# EasyEDA Pro project FLIGHT-CONTROLLER_VERSION_2.eprj

# Schematic FLIGHT CONTROLLER
Board Name: FLIGHT CONTROLLER; Create Date: 2025-07-14; Page Name: Sheet_1; Project Name: FLIGHT-CONTROLLER_VERSION-2; Schematic Name: FLIGHT CONTROLLER; Update Date: 2025-07-15; Add into BOM: yes; Company: Your Company; Convert to PCB: yes; Date: 2025-07-08; Draw By: Jinalka Herath; REV: 1.0; Sheet: 1/1; spicePre: .
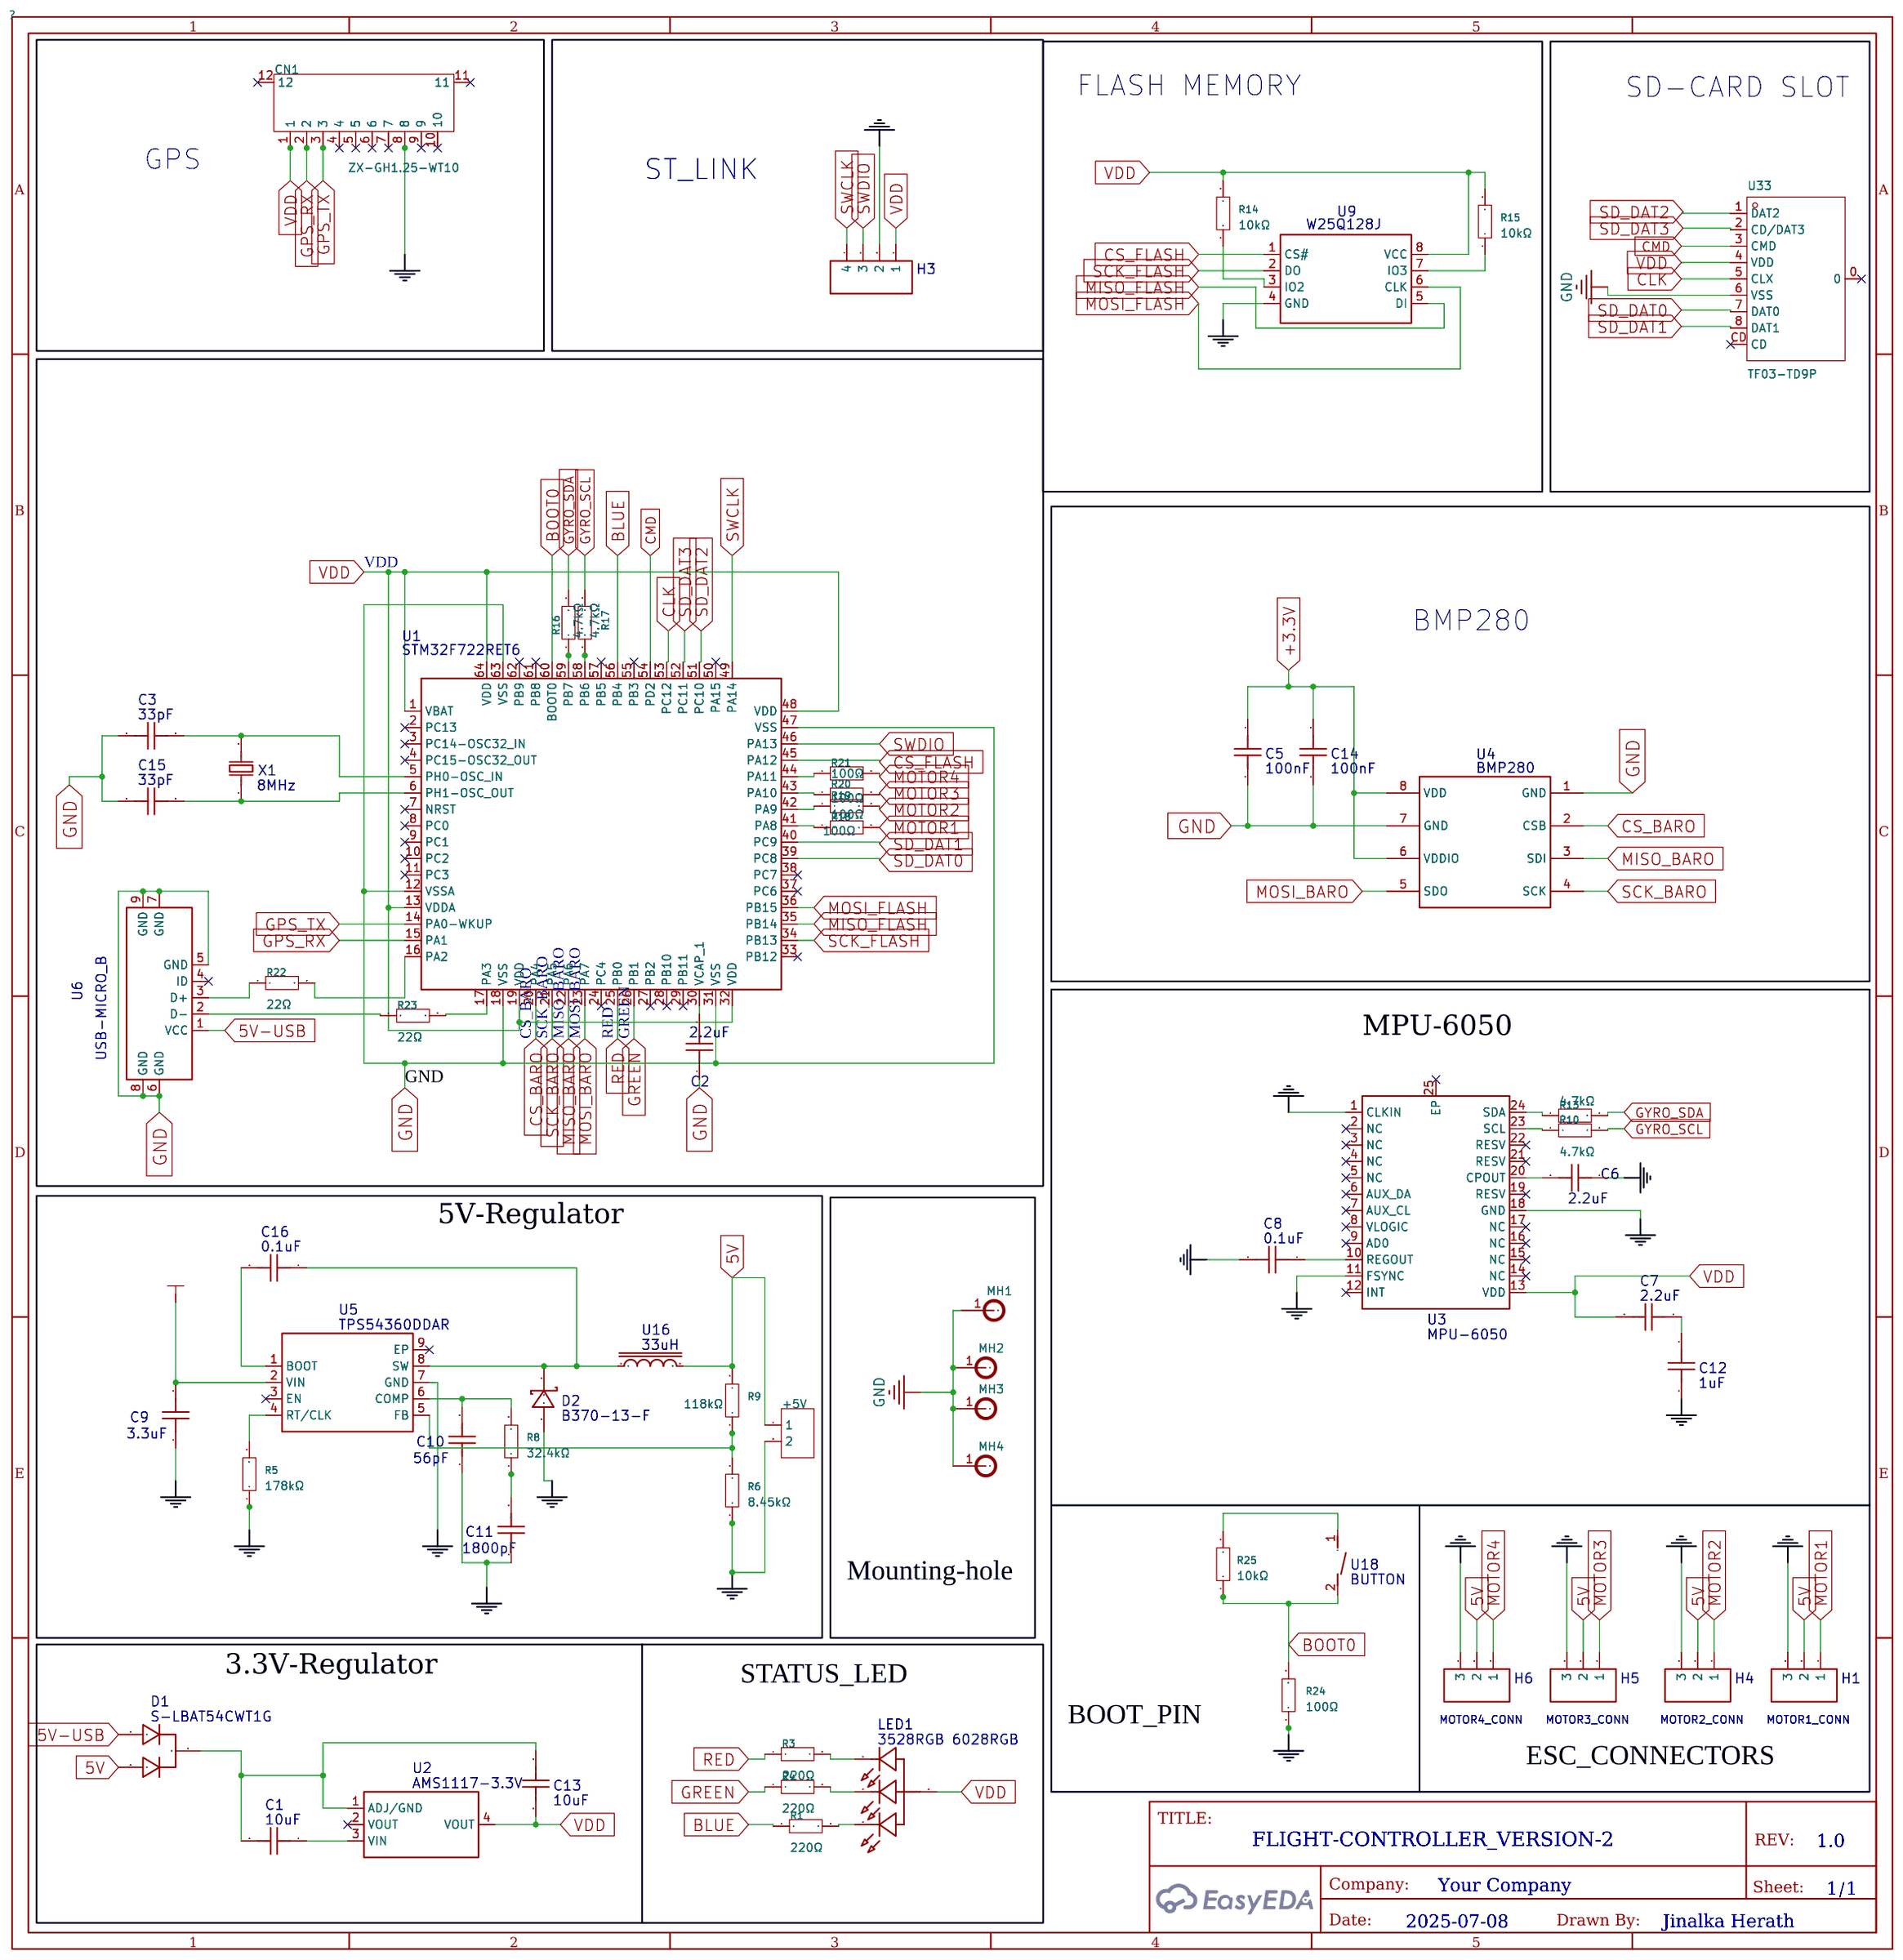
[diagram p0: schematic sheet]

## Parts
C1  10uF  [C0603]
C2  2.2uF  [CAP-SMD_L3.2-W2.5-1]
C3  33pF  [C0603]
C5  100nF  [C0603]
C6  2.2uF  [C0603]
C7  2.2uF  [C0603]
C8  0.1uF  [C0603]
C9  3.3uF  [C0603]
C10  56pF  [C0603]
C11  1800pF  [C0603]
C12  1uF  [C0603]
C13  10uF  [C0603]
C14  100nF  [C0603]
C15  33pF  [C0603]
C16  0.1uF  [C0603]
CN1  ZX-GH1.25-WT10  [CONN-SMD_ZX-GH1.25-WT10]
D1  S-LBAT54CWT1G  [SC-70-3_L2.0-W1.3-P1.30-LS2.1-BR]
D2  B370-13-F  [SMC_L7.1-W6.2-LS8.1-RD]
H1  MOTOR1_CONN  [HDR-F-2.54_1X3]
H3  ST_LINK  [HDR-F-2.54_1X4]
H4  MOTOR2_CONN  [HDR-F-2.54_1X3]
H5  MOTOR3_CONN  [HDR-F-2.54_1X3]
H6  MOTOR4_CONN  [HDR-F-2.54_1X3]
H7  +5V  [HDR-TH_2P-P2.54-V-F]
LED1  3528RGB 6028RGB  [LED-SMD_4P-L3.5-W2.8_3528RGB-6028RGB]
MH1  -  [MH_7.5]  (no BOM)
MH2  -  [MH_7.5]  (no BOM)
MH3  -  [MH_7.5]  (no BOM)
MH4  -  [MH_7.5]  (no BOM)
R1  220Ω  [R0805]
R3  220Ω  [R0805]
R4  220Ω  [R0805]
R5  178kΩ  [R0805]
R6  8.45kΩ  [R0805]
R8  32.4kΩ  [R0805]
R9  118kΩ  [R0805]
R10  4.7kΩ  [R0805]
R13  4.7kΩ  [R0805]
R14  10kΩ  [R0805]
R15  10kΩ  [R0805]
R16  4.7kΩ  [R0805]
R17  4.7kΩ  [R0805]
R18  100Ω  [R0805]
R19  100Ω  [R0805]
R20  100Ω  [R0805]
R21  100Ω  [R0805]
R22  22Ω  [R0805]
R23  22Ω  [R0805]
R24  100Ω  [R0805]
R25  10kΩ  [R0805]
U1  STM32F722RET6  [LQFP-64_L10.0-W10.0-P0.50-LS12.0-BL]
U2  AMS1117-3.3V  [SOT-223-4_L6.5-W3.5-P2.30-LS7.0-BR]
U3  MPU-6050  [QFN-24_L4.0-W4.0-P0.50-BL-EP2.7]
U4  BMP280  [LGA-8_L2.5-W2.0-P0.65_AMP6127]
U5  TPS54360DDAR  [ESOP-8_L4.9-W3.9-P1.27-LS6.0-BL-EP]
U6  USB-MICRO_B  [MICRO-USB-SMD_USB-MICRO_B]
U9  W25Q128J  [SOIC-8_L5.3-W5.3-P1.27-LS8.0-BL]
U16  33uH  [IND-SMD_L8.5-W8.0_SMS0850]
U18  BUTTON  [KEY-SMD_L6.0-W6.0-LS6.6]
U33  TF03-TD9P  [CONN-SMD_TF-001A-P]
X1  8MHz  [CRYSTAL-SMD_L3.2-W2.5_3225-8MHZ]

## Library data of the parts
C1 C13 = 10uF: Supplier: LCSC; Supplier Part: C3884822; Manufacturer: TDK; Manufacturer Part: C1608CH2A560J080AA; JLCPCB Part Class: Extended Part; Contributor: lcsc; nameAlias: Value; spicePre: C; spiceSymbolName: C1608CH2A560J080AA
C2 = 2.2uF: Supplier: LCSC; Supplier Part: C3778570; Manufacturer: rubycon(红宝石); Manufacturer Part: 25MU225MB23225; JLCPCB Part Class: Extended Part; Contributor: lcsc; nameAlias: Value; spicePre: C; spiceSymbolName: 25MU225MB23225
C3 C15 = 33pF: Supplier: LCSC; Supplier Part: C3884822; Manufacturer: TDK; Manufacturer Part: C1608CH2A560J080AA; JLCPCB Part Class: Extended Part; Contributor: lcsc; nameAlias: Value; spicePre: C; spiceSymbolName: C1608CH2A560J080AA
C5 C14 = 100nF: Supplier: LCSC; Supplier Part: C3884822; Manufacturer: TDK; Manufacturer Part: C1608CH2A560J080AA; JLCPCB Part Class: Extended Part; Contributor: lcsc; nameAlias: Value; spicePre: C; spiceSymbolName: C1608CH2A560J080AA
C6 C7 = 2.2uF: Supplier: LCSC; Supplier Part: C3884822; Manufacturer: TDK; Manufacturer Part: C1608CH2A560J080AA; JLCPCB Part Class: Extended Part; Contributor: lcsc; nameAlias: Value; spicePre: C; spiceSymbolName: C1608CH2A560J080AA
C8 C16 = 0.1uF: Supplier: LCSC; Supplier Part: C3884822; Manufacturer: TDK; Manufacturer Part: C1608CH2A560J080AA; JLCPCB Part Class: Extended Part; Contributor: lcsc; nameAlias: Value; spicePre: C; spiceSymbolName: C1608CH2A560J080AA
C9 = 3.3uF: Supplier: LCSC; Supplier Part: C3884822; Manufacturer: TDK; Manufacturer Part: C1608CH2A560J080AA; JLCPCB Part Class: Extended Part; Contributor: lcsc; nameAlias: Value; spicePre: C; spiceSymbolName: C1608CH2A560J080AA
C10 = 56pF: Supplier: LCSC; Supplier Part: C3884822; Manufacturer: TDK; Manufacturer Part: C1608CH2A560J080AA; JLCPCB Part Class: Extended Part; Contributor: lcsc; nameAlias: Value; spicePre: C; spiceSymbolName: C1608CH2A560J080AA
C11 = 1800pF: Supplier: LCSC; Supplier Part: C3884822; Manufacturer: TDK; Manufacturer Part: C1608CH2A560J080AA; JLCPCB Part Class: Extended Part; Contributor: lcsc; nameAlias: Value; spicePre: C; spiceSymbolName: C1608CH2A560J080AA
C12 = 1uF: Supplier: LCSC; Supplier Part: C3884822; Manufacturer: TDK; Manufacturer Part: C1608CH2A560J080AA; JLCPCB Part Class: Extended Part; Contributor: lcsc; nameAlias: Value; spicePre: C; spiceSymbolName: C1608CH2A560J080AA
CN1 = ZX-GH1.25-WT10: Pins Structure:1x10P Pitch:1.25mm Mounting Type:Surface Mount, Right Angle Reference Series:GH Number of Pins:10P Number of Rows:1 Number of PINs Per Row:10 Row Spacing:- Current Rating:1A Contact Material:Phosphor Bronze Contact Plating:Tin Operating Tem; LCSC Part Name: 1x10P 间距:1.25mm 卧贴 系列:GH; Supplier Part: C7429523; Manufacturer: Megastar(兆星); Supplier Footprint: SMD,P=1.25mm,卧贴; JLCPCB Part Class: Extended Part; Datasheet: https://atta.szlcsc.com/upload/public/pdf/source/20230619/4B2B28B10338DA0EF18CC8BF26211619.pdf; Supplier: LCSC; Pins Structure: 1x10P; Pitch: 1.25mm; Mounting Type: Surface Mount, Right Angle; Reference Series: GH; Number of Pins: 10P; Number of Rows: 1; Number of PINs Per Row: 10; Current Rating: 1A; Contact Material: Phosphor Bronze; Contact Plating: Tin; Operating Temperature: -25℃~+85℃; Voltage Rating: 125V; Plastic Material: LCP; Supplementary Features: Auxiliary Solder Pin; Color: Beige; Z-Height of the Board: 4.35mm; X-Length of Bottom Edge on Board (Spacing Line): 15.75mm; Y-Width of Bottom Edge on Board: 5mm
D1 = S-LBAT54CWT1G: Supplier: LCSC; Supplier Part: C2941716; Manufacturer: LRC(乐山无线电); JLCPCB Part Class: Extended Part; Contributor: lcsc; spicePre: D
D2 = B370-13-F: Supplier Part: C134456; Supplier: LCSC; Manufacturer: DIODES(美台); JLCPCB Part Class: Extended Part; Contributor: LCSC; spicePre: D
H1 = MOTOR1_CONN: Supplier Part: C146690; Supplier: LCSC; Contributor: LCEDA_Lib; spicePre: H; spiceSymbolName: HDR-F-2.54_1x3
H3 = ST_LINK: Supplier Part: C225501; Supplier: LCSC; Contributor: LCEDA_Lib; spicePre: H; spiceSymbolName: HDR-F-2.54_1x4
H4 = MOTOR2_CONN: Supplier Part: C146690; Supplier: LCSC; Contributor: LCEDA_Lib; spicePre: H; spiceSymbolName: HDR-F-2.54_1x3
H5 = MOTOR3_CONN: Supplier Part: C146690; Supplier: LCSC; Contributor: LCEDA_Lib; spicePre: H; spiceSymbolName: HDR-F-2.54_1x3
H6 = MOTOR4_CONN: Supplier Part: C146690; Supplier: LCSC; Contributor: LCEDA_Lib; spicePre: H; spiceSymbolName: HDR-F-2.54_1x3
H7 = HDR-F_2.54_1x2P: Supplier Footprint: Through
LED1 = 3528RGB 6028RGB: Supplier: LCSC; Supplier Part: C9900020542; Manufacturer: null; Manufacturer Part: 3528反贴RGB 6028反贴RGB 缺口蓝色; JLCPCB Part Class: Extended Part; Contributor: lcsc; spicePre: L
MH1-MH4 = MH_7.5
R1 R3-R6 R8-R10 R13-R25 = 0805W8F2200T5E: Type:Thick Film Resistors Resistance: Tolerance:±1% Tolerance:±1% Power(Watts): Overload Voltage (Max): Temperature Coefficient:±100ppm/℃ Temperature Coefficient:±100ppm/℃ Operating Temperature Range:-55℃~+155℃ Operating Temperature Range:-55℃~+155℃; LCSC Part Name: 220Ω ±1% 125mW 厚膜电阻; Supplier Part: C17557; Manufacturer: UNI-ROYAL(厚声); Supplier Footprint: 0805; JLCPCB Part Class: Basic Part; Datasheet: https://atta.szlcsc.com/upload/public/pdf/source/20200306/C422600_1E6D84923E4A46A82E41ADD87F860B5C.pdf; Supplier: LCSC; Type: Thick Film Resistors; Tolerance: ±1%; Temperature Coefficient: ±100ppm/℃; Operating Temperature Range: -55℃~+155℃
U1 = STM32F722RET6: Supplier: LCSC; Supplier Part: C118207; Manufacturer: ST(意法半导体); JLCPCB Part Class: Extended Part; Contributor: LCSC; spicePre: U
U2 = AMS1117-3.3V: Supplier: LCSC; Supplier Part: C2688239; Manufacturer: WPMtek(维攀); JLCPCB Part Class: Extended Part; Contributor: LCSC; spicePre: U
U3 = MPU-6050_C24112: Supplier: LCSC; Manufacturer: TDK InvenSense(应美盛); Supplier Part: C24112; JLCPCB Part Class: Extended Part; sourceId: 1T5FDZYC8; timeStamp: 1462265206; spicePre: U
U4 = BMP280: Supplier: LCSC; Manufacturer: Bosch(博世); Supplier Part: C83291; JLCPCB Part Class: Extended Part; spicePre: U
U5 = TPS54360DDAR(TOKMAS): Supplier: LCSC; Supplier Part: C7525413; Manufacturer: Tokmas(托克马斯); JLCPCB Part Class: Extended Part; Contributor: lcsc; spicePre: U
U6 = USB-MICRO_B: Supplier: LCSC; Supplier Part: C9900001367; Manufacturer: null; JLCPCB Part Class: Extended Part; Contributor: LCSC; spicePre: U
U9 = W25Q128JVSIQTR: Supplier: LCSC; Manufacturer: WINBOND(华邦); Manufacturer Part: W25Q128JVSIQ; Supplier Part: C97521; JLCPCB Part Class: Basic Part; spicePre: U
U16 = 33uH: Supplier: LCSC; Supplier Part: C7602869; Manufacturer: LanTu Micro(蓝图微电); Manufacturer Part: SMS0850-330MT; JLCPCB Part Class: Extended Part; nameAlias: Value; Contributor: lcsc; spicePre: U; spiceSymbolName: SMS0850-330MT
U18 = BUTTON: Supplier: LCSC; Supplier Part: C9900040040; Manufacturer: null; JLCPCB Part Class: Extended Part; Contributor: lcsc; spicePre: U; spiceSymbolName: BUTTON_C9900040040
U33 = TF03-TD9P: LCSC Part Name: 自弹式 MicroSD(TF卡）卡座; Supplier Part: C36936584; Manufacturer: BXCONN(宝讯); Supplier Footprint: SMD; Datasheet: https://atta.szlcsc.com/upload/public/pdf/source/20240731/E1986EBDAECF71B60F867BC7213E5175.pdf; Supplier: LCSC
X1 = 8MHz: Supplier: LCSC; Supplier Part: C42448903; Manufacturer: YXC(扬兴晶振); Manufacturer Part: X22EL89COI-111YLC-8M; JLCPCB Part Class: Extended Part; Contributor: lcsc; nameAlias: Value; spicePre: X; spiceSymbolName: X22EL89COI-111YLC-8M

## Nets
5V: D1.2 H1.2 H4.2 H5.2 H6.2 H7.1 R9.2 U16.2
5V-USB: D1.1 U6.1(VCC)
+3.3V: C5.1 C14.1 U4.6(VDDIO) U4.8(VDD)
GND: C2.1 C3.1 C5.2 C6.1 C8.2 C9.1 C10.1 C11.1 C12.2 C14.2 C15.1 CN1.8 D2.2(A) H1.3 H3.2 H4.3 H5.3 H6.3 H7.2 MH1.1 MH2.1 MH3.1 MH4.1 R5.1 R6.1 R24.1 U1.12(VSSA) U1.18(VSS) U1.31(VSS) U1.47(VSS) U1.63(VSS) U3.1(CLKIN) U3.11(FSYNC) U3.18(GND) U4.1(GND) U4.7(GND) U5.7(GND) U6.5(GND) U6.6(GND) U6.7(GND) U6.8(GND) U6.9(GND) U9.4(GND) U33.6(VSS)
VDD: C7.2 C13.2 CN1.1 H3.1 LED1.3(A) R14.2 R15.2 U1.1(VBAT) U1.13(VDDA) U1.19(VDD) U1.32(VDD) U1.48(VDD) U1.64(VDD) U2.4(VOUT) U3.13(VDD) U9.8(VCC) U33.4(VDD)
+BATT: C9.2 U5.2(VIN)
BLUE: R1.1 U1.56(PB4)
BOOT0: R24.2 R25.1 U1.60(BOOT0) U18.2(B)
CLK: U1.53(PC12) U33.5(CLX)
CMD: U1.54(PD2) U33.3(CMD)
CS_BARO: U1.20(PA4) U4.2(CSB)
CS_FLASH: U1.45(PA12) U9.1(CS#)
GPS_RX: CN1.2 U1.15(PA1)
GPS_TX: CN1.3 U1.14(PA0-WKUP)
GREEN: R4.1 U1.26(PB1)
GYRO_SCL: R10.2 R17.2
GYRO_SDA: R13.2 R16.2
MISO_BARO: U1.22(PA6) U4.3(SDI)
MISO_FLASH: U1.35(PB14) U9.5(DI)
MOSI_BARO: U1.23(PA7) U4.5(SDO)
MOSI_FLASH: U1.36(PB15) U9.6(CLK)
MOTOR1: H1.1 R18.2
MOTOR2: H4.1 R19.2
MOTOR3: H5.1 R20.2
MOTOR4: H6.1 R21.2
RED: R3.1 U1.25(PB0)
SCK_BARO: U1.21(PA5) U4.4(SCK)
SCK_FLASH: U1.34(PB13) U9.2(DO)
SD_DAT0: U1.39(PC8) U33.7(DAT0)
SD_DAT1: U1.40(PC9) U33.8(DAT1)
SD_DAT2: U1.51(PC10) U33.1(DAT2)
SD_DAT3: U1.52(PC11) U33.2(CD/DAT3)
SWCLK: H3.4 U1.49(PA14)
SWDIO: H3.3 U1.46(PA13)
$1N7: C2.2 U1.30(VCAP_1)
$1N9: C3.2 U1.5(PH0-OSC_IN) X1.2
$1N10: C15.2 U1.6(PH1-OSC_OUT) X1.1
$1N15: C8.1 U3.10(REGOUT)
$1N18: C7.1 C12.1
$1N20: C6.2 U3.20(CPOUT)
$1N23: C1.2 C13.1 D1.3 U2.1(ADJ/GND)
$1N24: C1.1 U2.3(VIN)
$1N83: C16.2 U5.1(BOOT)
$1N84: C16.1 D2.1(C) U5.8(SW) U16.1
Net-(C10-2): C10.2 R8.2 U5.6(COMP)
Net-(C11-2): C11.2 R8.1
Net-(LED1-1): LED1.1(B) R4.2
Net-(LED1-2): LED1.2(R) R3.2
Net-(LED1-4): LED1.4(G) R1.2
Net-(R5-2): R5.2 U5.4(RT/CLK)
Net-(R6-2): R6.2 R9.1 U5.5(FB)
Net-(R10-1): R10.1 U3.23(SCL)
Net-(R13-1): R13.1 U3.24(SDA)
Net-(R14-1): R14.1 U9.3(IO2)
Net-(R15-1): R15.1 U9.7(IO3)
Net-(R16-1): R16.1 U1.59(PB7)
Net-(R17-1): R17.1 U1.58(PB6)
Net-(R18-1): R18.1 U1.41(PA8)
Net-(R19-1): R19.1 U1.42(PA9)
Net-(R20-1): R20.1 U1.43(PA10)
Net-(R21-1): R21.1 U1.44(PA11)
Net-(R22-1): R22.1 U6.3(D+)
Net-(R22-2): R22.2 U1.16(PA2)
Net-(R23-1): R23.1 U6.2(D-)
Net-(R23-2): R23.2 U1.17(PA3)
Net-(R25-2): R25.2 U18.1(A)

Not connected (* = marked no-connect by the designer): CN1 4* 5* 6* 7* 9* 10* 11* 12*; U1 2(PC13)* 3(PC14-OSC32_IN)* 4(PC15-OSC32_OUT)* 7(NRST)* 8(PC0)* 9(PC1)* 10(PC2)* 11(PC3)* 24(PC4)* 27(PB2)* 28(PB10)* 29(PB11)* 33(PB12)* 37(PC6)* 38(PC7)* 50(PA15)* 55(PB3)* 57(PB5)* 61(PB8)* 62(PB9)*; U2 2(VOUT)*; U3 2(NC)* 3(NC)* 4(NC)* 5(NC)* 6(AUX_DA)* 7(AUX_CL)* 8(VLOGIC)* 9(AD0)* 12(INT)* 14(NC)* 15(NC)* 16(NC)* 17(NC)* 19(RESV)* 21(RESV)* 22(RESV)* 25(EP)*; U5 3(EN)* 9(EP)*; U6 4(ID)*; U33 0* CD*

## Notes on the sheet
- FLASH MEMORY
- SD-CARD SLOT
- GPS
- BMP280
- MPU-6050
- 5V-Regulator
- Mounting-hole
- 3.3V-Regulator
- STATUS_LED
- BOOT_PIN
- ESC_CONNECTORS

# Board PCB4
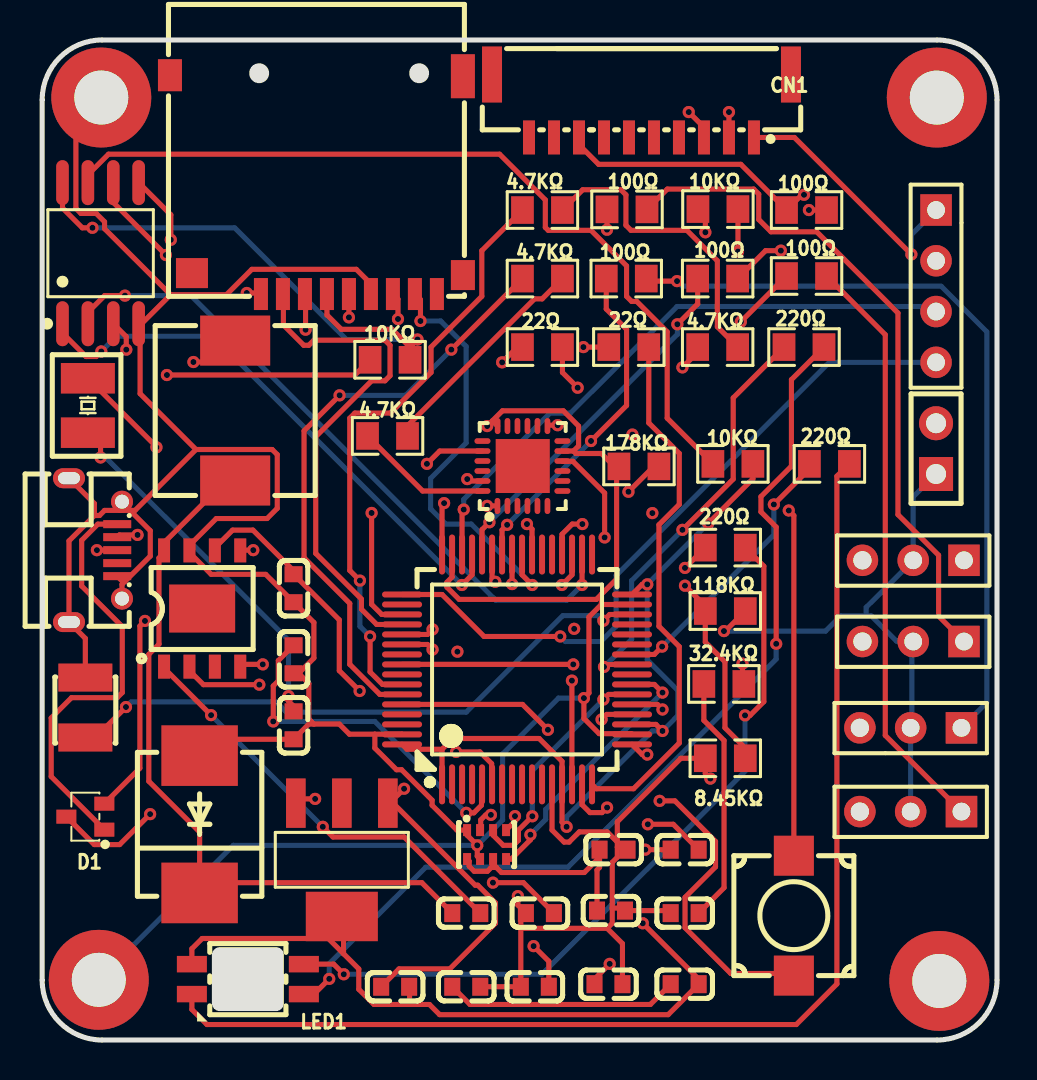
[diagram p1: board, top side]
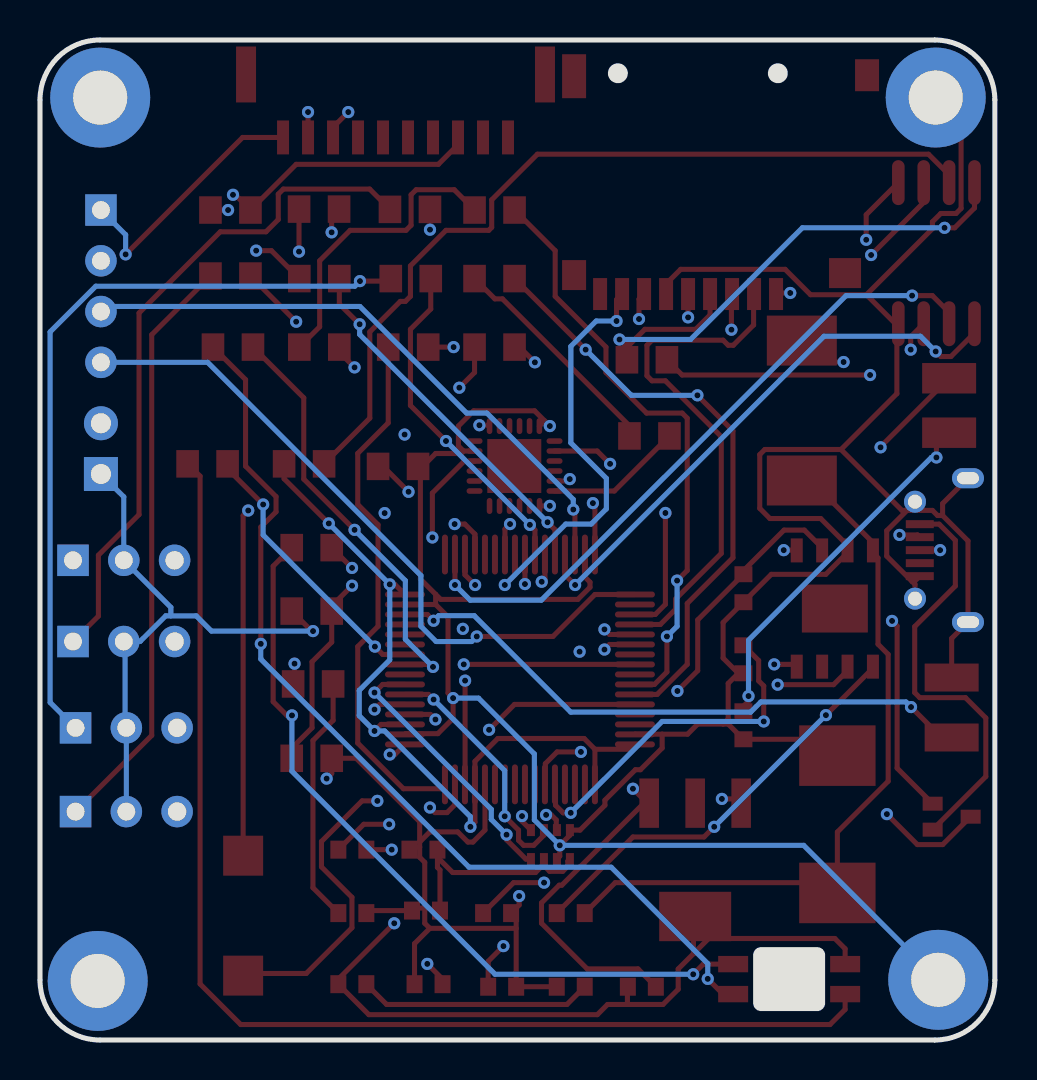
[diagram p2: board, bottom side, seen from below]

Outline 47.75 x 50.04 mm; copper layers: Top Layer, Inner1, Inner2, Bottom Layer. Coordinates in mm from the lower left corner of the outline.
Outline path: 0,47.04 0,3 arc(0.88,0.88) 3,0 44.75,0 arc(46.87,0.88) 47.75,3 47.75,47.04 arc(46.87,49.16) 44.75,50.04 3,50.04 arc(0.88,49.16) 0,47.04
Stack: Top Layer 0.035mm Outer layer thickness 1oz / Dielectric1 0.2104mm 7628 RC49% 8.6mil / Inner1 0.0152mm Inner layer thickness / Dielectric2 1.065mm 1.1mm H/HOZ Copper / Inner2 0.0152mm Inner layer thickness / Dielectric3 0.2104mm 7628 RC49% 8.6mil / Bottom Layer 0.035mm Outer layer thickness 1oz

## Design rules (mm)
template: JLCPCB Capability(Two Layers Board)
spacing copperThickness1oz (default): track to track 0.102, other pairs 0.152 to 0.3
spacing copperThickness2oz: track to track 0.203, other pairs 0.152 to 0.3
track width copperThickness1oz (default): min 0.127, default 0.254, max 2.54
track width copperThickness2oz: min 0.203, default 0.254, max 2.54
differential pair differentialPair (default): width min 0.127, default 0.254, max 2.54; gap min 0.152, default 0.152
via viaSize (default): diameter min 0.5, default 0.61, max 10; hole min 0.3, default 0.305, max 6.3
pour e16520 uses copperRegion

## Placement (name value [footprint] x y rotation side)
4.7KΩ  -  [R0805]  33.78 34.67 0 top
4.7KΩ#2  -  [R0805]  17.27 30.23 0 top
4.7KΩ#3  -  [R0805]  25.02 38.1 0 top
4.7KΩ#4  -  [R0805]  25.02 41.53 0 top
8.45KΩ  8.45kΩ  [R0805]  34.16 14.1 0 top
10KΩ  -  [R0805]  17.4 34.04 0 top
10KΩ#2  -  [R0805]  34.54 28.83 0 top
10KΩ#3  -  [R0805]  33.8 41.58 0 top
22Ω  -  [R0805]  29.34 34.67 0 top
22Ω#2  -  [R0805]  25.02 34.67 0 top
32.4KΩ  32.4kΩ  [R0805]  34.09 17.82 0 top
100Ω  -  [R0805]  38.23 38.23 0 top
100Ω#2  -  [R0805]  29.21 38.1 0 top
100Ω#3  -  [R0805]  29.25 41.56 0 top
100Ω#4  -  [R0805]  33.78 38.1 0 top
100Ω#5  -  [R0805]  38.23 41.53 0 top
118KΩ  118kΩ  [R0805]  34.16 21.46 0 top
178KΩ  178kΩ  [R0805]  29.85 28.7 0 top
220Ω  -  [R0805]  34.16 24.64 0 top
220Ω#2  -  [R0805]  38.1 34.67 0 top
220Ω#3  -  [R0805]  39.37 28.83 0 top
C1  10uF  [C0603]  32.13 9.53 0 top
C2  2.2uF  [CAP-SMD_L3.2-W2.5-1]  2.16 16.64 270 top
C3  33pF  [C0603]  12.57 19.05 90 top
C5  100nF  [C0603]  28.45 6.48 0 top
C6  2.2uF  [C0603]  24.64 2.67 0 top
C7  2.2uF  [C0603]  32.13 2.79 0 top
C8  0.1uF  [C0603]  28.32 2.79 0 top
C9  3.3uF  [C0603]  24.89 6.35 0 top
C10  56pF  [C0603]  12.57 22.61 90 top
C11  1800pF  [C0603]  32.13 6.35 0 top
C12  1uF  [C0603]  21.21 2.67 0 top
C13  10uF  [C0603]  17.65 2.67 0 top
C14  100nF  [C0603]  28.58 9.53 0 top
C15  33pF  [C0603]  12.57 15.75 90 top
C16  0.1uF  [C0603]  21.21 6.35 0 top
CN1  ZX-GH1.25-WT10  [CONN-SMD_ZX-GH1.25-WT10]  29.97 46.74 180 top
D1  S-LBAT54CWT1G  [SC-70-3_L2.0-W1.3-P1.30-LS2.1-BR]  2.16 11.18 0 top
D2  B370-13-F  [SMC_L7.1-W6.2-LS8.1-RD]  7.87 10.8 90 top
H1  MOTOR1_CONN  [HDR-F-2.54_1X3]  43.43 11.43 180 top
H3  ST_LINK  [HDR-F-2.54_1X4]  44.7 37.72 270 top
H4  MOTOR2_CONN  [HDR-F-2.54_1X3]  43.43 15.62 180 top
H5  MOTOR3_CONN  [HDR-F-2.54_1X3]  43.56 19.94 180 top
H6  MOTOR4_CONN  [HDR-F-2.54_1X3]  43.56 24 180 top
H7  +5V  [HDR-TH_2P-P2.54-V-F]  44.7 29.59 90 top
LED1  3528RGB 6028RGB  [LED-SMD_4P-L3.5-W2.8_3528RGB-6028RGB]  10.29 3.05 0 top
MH1  -  [MH_7.5]  2.96 47.54 0 top
MH2  -  [MH_7.5]  44.74 47.54 0 top
MH3  -  [MH_7.5]  44.87 3.34 0 top
MH4  -  [MH_7.5]  2.83 3.39 0 top
U1  STM32F722RET6  [LQFP-64_L10.0-W10.0-P0.50-LS12.0-BL]  23.75 18.54 0 top
U2  AMS1117-3.3V  [SOT-223-4_L6.5-W3.5-P2.30-LS7.0-BR]  14.99 9.02 90 top
U3  MPU-6050  [QFN-24_L4.0-W4.0-P0.50-BL-EP2.7]  24.02 28.72 0 top
U4  BMP280  [LGA-8_L2.5-W2.0-P0.65_AMP6127]  22.23 9.78 90 top
U5  TPS54360DDAR  [ESOP-8_L4.9-W3.9-P1.27-LS6.0-BL-EP]  8 21.59 0 top
U6  USB-MICRO_B  [MICRO-USB-SMD_USB-MICRO_B]  2.67 24.51 270 top
U9  W25Q128J  [SOIC-8_L5.3-W5.3-P1.27-LS8.0-BL]  2.92 39.37 0 top
U16  33uH  [IND-SMD_L8.5-W8.0_SMS0850]  9.65 31.5 90 top
U18  BUTTON  [KEY-SMD_L6.0-W6.0-LS6.6]  37.59 6.22 270 top
U33  TF03-TD9P  [CONN-SMD_TF-001A-P]  13.72 42.8 180 top
X1  8MHz  [CRYSTAL-SMD_L3.2-W2.5_3225-8MHZ]  2.29 31.75 90 top

## Footprints (pads in the part's own frame, mm; a bottom-side part is the same pattern mirrored in y, then rotated)
C0603
  rect 0.8x0.9 smd: 1(-0.7,0) 2(0.7,0)
CAP-SMD_L3.2-W2.5-1
  rect 1.4x2.7 smd: 1(-1.5,0) 2(1.5,0)
CONN-SMD_TF-001A-P
  rect 1.2x1.5 smd: 0(-7.325,4.524)
  rect 1.2x2.2 smd: 0(-7.325,-5.426)
  rect 1.6x1.5 smd: 0(6.225,4.426)
  rect 1.2x1.6 smd: 0(7.325,-5.474)
  rect 0.7x1.6 smd: 1(2.775,5.474) 2(1.675,5.474) 3(0.575,5.474) 4(-0.525,5.474) 5(-1.625,5.474) 6(-2.725,5.474) 7(-3.825,5.474) 8(-4.925,5.474) CD(-6.025,5.474)
CONN-SMD_ZX-GH1.25-WT10
  rect 0.6x1.7 smd: 1(-5.625,1.575) 2(-4.375,1.575) 3(-3.125,1.575) 4(-1.875,1.575) 5(-0.625,1.575) 6(0.625,1.575) 7(1.875,1.575) 8(3.125,1.575) 9(4.375,1.575) 10(5.625,1.575)
  rect 1x2.8 smd: 11(7.475,-1.575) 12(-7.475,-1.575)
CRYSTAL-SMD_L3.2-W2.5_3225-8MHZ
  rect 1.524x2.7 smd: 1(-1.362,0) 2(1.362,0)
ESOP-8_L4.9-W3.9-P1.27-LS6.0-BL-EP
  rect 0.6x1.2 smd: 1(-1.905,-2.909) 2(-0.635,-2.909) 3(0.635,-2.909) 4(1.905,-2.909) 5(1.905,2.909) 6(0.635,2.909) 7(-0.635,2.909) 8(-1.905,2.909)
  rect 3.3x2.4 smd: 9(0,0)
HDR-F-2.54_1X3
  rect 1.575x1.575 hole 0.889: 1(-2.54,0)
  round 1.575 hole 0.889: 2(0,0)
  round 1.575 hole 0.914: 3(2.54,0)
HDR-F-2.54_1X4
  rect 1.575x1.575 hole 0.889: 1(-3.81,0)
  round 1.575 hole 0.889: 2(-1.27,0) 3(1.27,0) 4(3.81,0)
HDR-TH_2P-P2.54-V-F
  rect 1.7x1.7 hole 1: 1(-1.27,0)
  round 1.7 hole 1: 2(1.27,0)
IND-SMD_L8.5-W8.0_SMS0850
  rect 2.5x3.5 smd: 1(-3.5,0) 2(3.5,0)
KEY-SMD_L6.0-W6.0-LS6.6
  rect 2x2 smd: 1(-3,0) 2(3,0)
LED-SMD_4P-L3.5-W2.8_3528RGB-6028RGB
  rect 1.5x0.82 smd: 1(-2.8,-0.75) 2(2.8,-0.75) 3(-2.8,0.75) 4(2.8,0.75)
LGA-8_L2.5-W2.0-P0.65_AMP6127
  rect 0.6x0.4 smd: 1(0.725,0.975) 2(0.725,0.325) 3(0.725,-0.325) 4(0.725,-0.975) 5(-0.725,-0.975) 6(-0.725,-0.325) 7(-0.725,0.325) 8(-0.725,0.975)
LQFP-64_L10.0-W10.0-P0.50-LS12.0-BL
  oval 0.3x2 smd: 1(-3.75,-5.75) 2(-3.25,-5.75) 3(-2.75,-5.75) 4(-2.25,-5.75) 5(-1.75,-5.75) 6(-1.25,-5.75) 7(-0.75,-5.75) 8(-0.25,-5.75) 9(0.25,-5.75) 10(0.75,-5.75) 11(1.25,-5.75) 12(1.75,-5.75) 13(2.25,-5.75) 14(2.75,-5.75) 15(3.25,-5.75) 16(3.75,-5.75) 33(3.75,5.75) 34(3.25,5.75) 35(2.75,5.75) 36(2.25,5.75) 37(1.75,5.75) 38(1.25,5.75) 39(0.75,5.75) 40(0.25,5.75) 41(-0.25,5.75) 42(-0.75,5.75) 43(-1.25,5.75) 44(-1.75,5.75) 45(-2.25,5.75) 46(-2.75,5.75) 47(-3.25,5.75) 48(-3.75,5.75)
  oval 2x0.3 smd: 17(5.75,-3.75) 18(5.75,-3.25) 19(5.75,-2.75) 20(5.75,-2.25) 21(5.75,-1.75) 22(5.75,-1.25) 23(5.75,-0.75) 24(5.75,-0.25) 25(5.75,0.25) 26(5.75,0.75) 27(5.75,1.25) 28(5.75,1.75) 29(5.75,2.25) 30(5.75,2.75) 31(5.75,3.25) 32(5.75,3.75) 49(-5.75,3.75) 50(-5.75,3.25) 51(-5.75,2.75) 52(-5.75,2.25) 53(-5.75,1.75) 54(-5.75,1.25) 55(-5.75,0.75) 56(-5.75,0.25) 57(-5.75,-0.25) 58(-5.75,-0.75) 59(-5.75,-1.25) 60(-5.75,-1.75) 61(-5.75,-2.25) 62(-5.75,-2.75) 63(-5.75,-3.25) 64(-5.75,-3.75)
MH_7.5
  round 5 hole 2.7: 1(0,-0.381)
MICRO-USB-SMD_USB-MICRO_B
  rect 0.4x1.4 smd: 1(-1.3,1.086) 2(-0.65,1.086) 3(0,1.086) 4(0.65,1.086) 5(1.3,1.086)
  oval 1x1.6 hole 0.6x1.1: 6(3.6,-1.325) 7(-3.6,-1.325)
  round 1.1 hole 0.7: 8(2.425,1.325) 9(-2.425,1.325)
QFN-24_L4.0-W4.0-P0.50-BL-EP2.7
  oval 0.28x0.8 smd: 1(-1.25,-2) 2(-0.75,-2) 3(-0.25,-2) 4(0.25,-2) 5(0.75,-2) 6(1.25,-2) 13(1.25,2) 14(0.75,2) 15(0.25,2) 16(-0.25,2) 17(-0.75,2) 18(-1.242,2)
  oval 0.8x0.28 smd: 7(2,-1.25) 8(2,-0.75) 9(2,-0.25) 10(2,0.25) 11(2,0.75) 12(2,1.25) 19(-2,1.25) 20(-2,0.75) 21(-2,0.25) 22(-2,-0.25) 23(-2,-0.75) 24(-2,-1.25)
  rect 2.7x2.7 smd: 25(0.013,0)
R0805
  rect 1.133x1.377 smd: 1(-1,0) 2(1,0)
SC-70-3_L2.0-W1.3-P1.30-LS2.1-BR
  rect 1x0.7 smd: 1(0.95,-0.65) 2(0.95,0.65) 3(-0.95,-0.001)
SMC_L7.1-W6.2-LS8.1-RD
  rect 3.03x3.82 smd: 1(-3.435,0) 2(3.435,0)
SOIC-8_L5.3-W5.3-P1.27-LS8.0-BL
  oval 0.63x2.25 smd: 1(-1.905,-3.53) 2(-0.635,-3.53) 3(0.635,-3.53) 4(1.905,-3.53) 5(1.905,3.53) 6(0.635,3.53) 7(-0.635,3.53) 8(-1.905,3.53)
SOT-223-4_L6.5-W3.5-P2.30-LS7.0-BR
  rect 2.47x0.98 smd: 1(2.835,-2.3) 2(2.835,0) 3(2.835,2.3)
  rect 2.47x3.6 smd: 4(-2.835,0)

## Nets
5V: 118KΩ.2 D1.2 H1.2 H4.2 H5.2 H6.2 H7.1 U16.2
5V-USB: D1.1 U6.1
+3.3V: C5.1 C14.1 U4.6 U4.8
GND: 8.45KΩ.1 100Ω#5.1 178KΩ.1 C2.1 C3.1 C5.2 C6.1 C8.2 C9.1 C10.1 C11.1 C12.2 C14.2 C15.1 CN1.8 D2.2 H1.3 H3.2 H4.3 H5.3 H6.3 H7.2 MH1.1 MH2.1 MH3.1 MH4.1 U1.12 U1.18 U1.31 U1.47 U1.63 U3.1 U3.11 U3.18 U4.1 U4.7 U5.7 U6.5 U6.6 U6.7 U6.8 U6.9 U9.4 U33.6
VDD: 10KΩ.2 10KΩ#2.2 C7.2 C13.2 CN1.1 H3.1 LED1.3 U1.1 U1.13 U1.19 U1.32 U1.48 U1.64 U2.4 U3.13 U9.8 U33.4
+BATT: C9.2 U5.2
BLUE: 220Ω.1 U1.56
BOOT0: 10KΩ#3.1 100Ω#5.2 U1.60 U18.2
CLK: U1.53 U33.5
CMD: U1.54 U33.3
CS_BARO: U1.20 U4.2
CS_FLASH: U1.45 U9.1
GPS_RX: CN1.2 U1.15
GPS_TX: CN1.3 U1.14
GREEN: 220Ω#3.1 U1.26
GYRO_SCL: 4.7KΩ.2 4.7KΩ#4.2
GYRO_SDA: 4.7KΩ#2.2 4.7KΩ#3.2
MISO_BARO: U1.22 U4.3
MISO_FLASH: U1.35 U9.5
MOSI_BARO: U1.23 U4.5
MOSI_FLASH: U1.36 U9.6
MOTOR1: 100Ω.2 H1.1
MOTOR2: 100Ω#2.2 H4.1
MOTOR3: 100Ω#3.2 H5.1
MOTOR4: 100Ω#4.2 H6.1
RED: 220Ω#2.1 U1.25
SCK_BARO: U1.21 U4.4
SCK_FLASH: U1.34 U9.2
SD_DAT0: U1.39 U33.7
SD_DAT1: U1.40 U33.8
SD_DAT2: U1.51 U33.1
SD_DAT3: U1.52 U33.2
SWCLK: H3.4 U1.49
SWDIO: H3.3 U1.46
$1N1: 22Ω#2.2 U1.17
$1N2: 22Ω#2.1 U6.2
$1N3: 22Ω.2 U1.16
$1N4: 22Ω.1 U6.3
$1N7: C2.2 U1.30
$1N9: C3.2 U1.5 X1.2
$1N10: C15.2 U1.6 X1.1
$1N15: C8.1 U3.10
$1N18: C7.1 C12.1
$1N20: C6.2 U3.20
$1N23: C1.2 C13.1 D1.3 U2.1
$1N24: C1.1 U2.3
$1N49: 10KΩ.1 U9.3
$1N50: 10KΩ#2.1 U9.7
$1N54: 100Ω#2.1 U1.42
$1N55: 100Ω#3.1 U1.43
$1N56: 100Ω#4.1 U1.44
$1N58: 4.7KΩ#2.1 U3.24
$1N60: 4.7KΩ.1 U3.23
$1N63: 4.7KΩ#4.1 U1.58
$1N64: 4.7KΩ#3.1 U1.59
$1N71: 100Ω.1 U1.41
$1N83: C16.2 U5.1
$1N84: C16.1 D2.1 U5.8 U16.1
$1N87: 32.4KΩ.2 C10.2 U5.6
$1N88: 32.4KΩ.1 C11.2
$1N90: 178KΩ.2 U5.4
$1N93: 8.45KΩ.2 118KΩ.1 U5.5
$1N107: 10KΩ#3.2 U18.1
$1N112: 220Ω#2.2 LED1.2
$1N113: 220Ω#3.2 LED1.1
$1N114: 220Ω.2 LED1.4

Pads without a net: CN1 4 5 6 7 9 10 11 12; U1 2 3 4 7 8 9 10 11 24 27 28 29 33 37 38 50 55 57 61 62; U2 2; U3 2 3 4 5 6 7 8 9 12 14 15 16 17 19 21 22 25; U5 3 9; U6 4; U33 0 CD

## Via types
v1: diameter 0.61, hole 0.305, Top Layer to Bottom Layer, 123 vias

## Routing (per net, layer and track width the routed paths; a pad name or vN(x,y) marks a point on that pad's centre or on a via; arc(x,y) is an arc through that point)
5V: length 83.4
  Top Layer w0.254: D1.2 4.89,13.6 4.89,20.72 v1(5.14,20.97) ; v1(34.1,20.46) 34.16,20.46 118KΩ.2 ; v1(7.56,33.92) 8.58,33.92 U16.2
  Inner1 w0.254: 8.7,24.53 8.7,32.79 v1(7.56,33.92) ; 8.7,24.53 v1(5.14,20.97) ; 8.7,24.53 11.49,21.73 32.83,21.73 v1(34.1,20.46)
  Bottom Layer w0.254: 43.5,19.95 43.5,15.68 H4.2 H1.2 ; 43.5,19.95 42.73,19.95 41.46,21.22 41.21,21.22 ; 43.5,19.95 H5.2 ; 41.21,21.22 41.21,21.65 H6.2 43.56,27.18 H7.1 ; 41.21,21.22 39.94,21.22 39.18,20.46 v1(34.1,20.46)
5V-USB: length 21.3
  Top Layer w0.254: U6.1 2.78,25.81 1.98,25 1.98,22.72 4.01,20.69 4.01,17.38 3.75,17.13 1.47,17.13 0.45,16.11 0.45,13.18 D1.1
+3.3V: length 11.1
  Top Layer w0.254: 22.71,8.64 22.55,8.8 U4.6 ; 22.71,8.64 22.46,8.64 22.27,8.44 21.61,8.44 21.35,8.7 21.35,8.95 U4.8 ; 22.71,8.64 22.97,8.38 27.11,8.38 27.88,9.14 ; 27.88,9.14 27.88,8.64 27.75,8.51 C5.1 ; 27.88,9.14 C14.1
GND: length 296.3
  Top Layer w0.254: 4.39,26.5 4.64,26.5 7.69,29.55 ; 4.39,26.5 3.88,26.5 ; 4.39,26.5 5.41,25.48 5.41,24.21 4.14,22.94 ; 16.64,15.3 17.99,15.3 U1.63 ; 16.64,15.3 16.64,14.61 17.72,13.52 17.98,13.52 19.5,12 19.5,11.75 20.74,10.5 U4.1 21.25,10.25 v1(21.76,9.74) 21.76,9.2 U4.7 ; 16.64,15.3 15.37,15.3 14.86,15.81 13.59,15.81 ; U33.6 16.44,37.83 15.71,38.56 10.49,38.56 9.22,37.29 6.42,37.29 ; v1(33.42,13.08) 33.16,13.34 8.45KΩ.1 31.94,14.1 28.76,10.92 28.76,9.91 ; C14.2 29.15,9.65 28.76,9.65 ; 13.59,15.81 13.33,16.06 13.33,17.84 12.83,18.35 ; 13.59,15.81 13.33,15.81 C15.1 8.69,15.05 D2.2 ; 28.51,6.6 28.51,5.84 28.26,5.59 ; 28.51,6.6 29.02,6.6 29.15,6.48 31.3,6.48 C11.1 ; 28.51,6.6 28.51,8.89 28.76,9.14 28.76,9.65 ; 28.76,9.65 28.76,9.91 ; 28.76,9.91 28.26,10.41 26.86,10.41 26.35,9.91 26.1,9.91 25.5,10.51 U1.12 ; 6.42,37.29 3.12,40.59 3.12,40.94 2.7,41.36 1.94,41.36 1.69,41.61 1.69,45.89 MH1.1 ; 6.42,37.29 4.9,35.77 ; 22.51,30.97 v1(22.25,30.72) ; 22.51,30.97 23.02,31.48 26.06,31.48 26.83,30.72 26.83,29.72 26.57,29.47 ; 22.51,30.97 U3.18 ; v1(22.25,26.73) 22.76,26.73 ; 7.69,29.55 11.5,29.55 11.76,29.29 11.76,26.6 11.25,26.09 8.71,26.09 7.44,24.82 7.44,24.57 ; 7.69,29.55 4.9,32.34 4.9,35.77 ; 4.14,22.94 4.02,22.94 U6.5 ; 4.14,22.94 3.99,22.8 U6.8 ; 28.73,28.59 27.97,29.35 26.7,29.35 26.57,29.47 ; 28.73,28.59 28.73,23.06 27.97,22.3 ; 28.73,28.59 178KΩ.1 ; 23.94,5.59 C6.1 C12.2 ; 23.94,5.59 23.94,6.1 C9.1 23.79,6.75 v1(23.79,7.2) ; 23.94,5.59 28.26,5.59 ; CN1.8 26.85,44.8 27.83,43.81 34.94,43.81 100Ω#5.1 37.99,42.29 v1(38.1,42.29) ; C8.2 29.02,4.82 28.26,5.59 ; 3.88,26.5 3.88,26.83 U6.9 ; 3.88,26.5 3.12,26.5 2.87,26.25 2.61,26.25 ; C2.1 2.16,20.09 U6.6 1.34,24.97 2.61,26.25 ; 7.44,24.57 7.44,24.32 8.45,23.3 11.18,23.3 13.59,20.89 13.59,19.11 12.83,18.35 ; 7.44,24.57 U5.7 ; 26.57,29.47 U3.11 ; 27.97,22.3 27.71,22.05 20.85,22.05 20.25,22.66 20.25,22.91 20.5,23.16 U1.47 ; 27.97,22.3 27.97,21.79 ; 27.97,21.79 U1.31 ; 27.97,21.79 27.35,21.17 27.35,17.36 v1(27.09,17.11) 27.09,16.09 27.85,15.33 29.46,15.33 U1.18 ; 2.61,26.25 2.61,26.84 U6.7 ; 4.9,35.77 U9.4 ; 12.83,18.35 C3.1
  Inner1 w0.254: v1(38.1,42.29) 38.61,42.8 44.7,42.8 ; v1(21.76,9.74) 23.79,7.71 v1(23.79,7.2) ; v1(33.42,13.08) 38.35,13.08 40.89,15.62 ; MH3.1 40.89,6.93 40.89,15.62 ; v1(22.25,30.72) v1(22.25,26.73) ; 40.89,15.62 40.89,19.81 H5.3 H6.3 41.02,27.18 H7.2 45.97,32.13 45.97,37.72 H3.2 45.97,40.26 45.97,42.29 45.47,42.8 44.7,42.8 ; MH2.1 44.7,47.12 44.7,42.8
  Bottom Layer w0.254: v1(27.09,17.11) 25.82,17.11 23.03,14.31 23.03,11.01 v1(21.76,9.74) 9.56,9.74 MH4.1
VDD: length 172.3
  Top Layer w0.254: 15.07,4.32 14.31,5.08 8,5.08 7.49,4.57 LED1.3 ; 15.07,4.32 15.07,6.1 U2.4 ; 15.07,4.32 15.83,3.56 15.83,2.54 16.6,1.78 18.37,1.78 ; 18.37,1.78 18.37,2.65 C13.2 ; 18.37,1.78 19.37,1.78 19.88,1.27 31.31,1.27 C7.2 32.83,3.05 v1(30.04,5.84) ; U3.13 25.31,30.76 v1(25.78,30.76) ; v1(20.1,26.86) 20,26.76 U1.48 ; 18.52,34.8 18.26,34.8 17.5,35.56 14.96,35.56 14.24,36.28 U33.4 ; 18.52,34.8 18.52,34.15 10KΩ.2 ; 18.52,34.8 v1(18.77,35.05) ; v1(31.02,15.46) 30.69,15.79 U1.19 ; 20,14.55 20.54,15.09 24.86,15.09 26,13.94 U1.13 26,10.9 v1(26.23,10.67) ; 20,14.55 18.24,14.55 U1.64 ; 20,14.55 U1.1 ; U9.8 1.02,41.63 2.01,40.64 v1(2.52,40.64) ; v1(30.26,22.8) 30.01,22.8 U1.32 ; v1(33.31,25.85) 35.54,28.08 10KΩ#2.2 ; v1(43.47,39.31) 37.62,45.16 CN1.1
  Inner1 w0.254: v1(25.78,30.76) 24.67,29.66 24.17,29.66 ; 21.88,31.18 21.88,31.94 v1(18.77,35.05) ; 21.88,31.18 22.13,31.44 22.39,31.44 24.17,29.66 ; 21.88,31.18 20.1,29.4 v1(20.1,26.86) ; v1(43.47,39.31) 43.47,38.8 33.31,28.64 v1(33.31,25.85) 32.29,24.83 31.02,24.83 26.41,29.44 24.38,29.44 24.17,29.66 ; v1(26.23,10.67) 26.23,9.65 v1(30.04,5.84)
  Bottom Layer w0.254: v1(33.31,25.85) v1(30.26,22.8) 30.26,19.02 31.79,17.5 31.79,16.23 v1(31.02,15.46) 30.52,15.46 26.23,11.18 v1(26.23,10.67) ; v1(18.77,35.05) 15.22,35.05 9.63,40.64 v1(2.52,40.64) ; v1(43.47,39.31) 43.47,40.29 H3.1
+BATT: length 23.5
  Top Layer w0.254: v1(22.54,7.87) 24.07,7.87 C9.2 ; U5.2 7.37,18.48 8.07,17.78 v1(10.86,17.78)
  Inner2 w0.254: v1(22.54,7.87) 20.77,7.87 v1(10.86,17.78)
BLUE: length 17.6
  Top Layer w0.254: 220Ω.1 v1(32.15,23.62) ; v1(26.56,18.8) 18,18.8
  Inner2 w0.254: v1(26.56,18.8) 27.32,18.8 v1(32.15,23.62)
BOOT0: length 69.7
  Top Layer w0.254: v1(38.35,41.53) 100Ω#5.2 ; U18.2 37.48,3.33 34.44,3.33 32.15,5.62 32.15,7.14 33.67,8.66 33.67,9.93 31.64,11.97 v1(30.88,11.97) ; v1(25.29,15.52) 24.02,16.79 U1.60 ; v1(33.17,40.41) 33.17,41.2 10KΩ#3.1
  Inner1 w0.254: v1(33.17,40.41) 37.23,40.41 v1(38.35,41.53)
  Inner2 w0.254: v1(33.17,40.41) 33.17,39.91 36.22,36.86 36.22,32.29 35.96,32.03 35.96,18.32 30.88,13.24 v1(30.88,11.97) 30.37,11.97 26.82,15.52 v1(25.29,15.52)
CLK: length 20.1
  Top Layer w0.254: v1(15.34,36.16) U33.5 ; v1(19.52,20.55) 19.27,20.29 U1.53
  Inner2 w0.254: v1(19.52,20.55) 15.46,24.61 15.46,36.04 v1(15.34,36.16)
CMD: length 22.7
  Top Layer w0.254: U33.3 13.17,37.29 v1(13.17,35.54) ; U1.54 19.27,19.79 v1(19.52,19.54)
  Inner2 w0.254: v1(13.17,35.54) 13.17,24.87 18.51,19.54 v1(19.52,19.54)
CS_BARO: length 10.3
  Top Layer w0.254: U1.20 28.23,16.29 v1(27.98,16.04) ; U4.2 21.93,10.54 21.93,11.01 22.19,11.27 v1(22.44,11.27)
  Inner1 w0.254: v1(27.98,16.04) 27.21,16.04 v1(22.44,11.27)
CS_FLASH: length 28.2
  Top Layer w0.254: U1.45 21.5,23.28 v1(20.99,22.77) ; v1(2.96,34.45) 2.7,34.2 2.2,34.2 1.02,35.38 U9.1
  Bottom Layer w0.254: v1(2.96,34.45) 3.72,35.21 8.55,35.21 v1(20.99,22.77)
GPS_RX: length 47.2
  Top Layer w0.254: U1.15 27,11.78 27.4,11.38 28,11.38 v1(28.25,11.63) ; CN1.2 v1(34.35,46.43)
  Inner2 w0.254: v1(28.25,11.63) 28.51,11.38 32.57,11.38 38.16,16.97 38.16,37.29 34.35,41.1 v1(34.35,46.43)
GPS_TX: length 41
  Top Layer w0.254: CN1.3 33.1,45.67 v1(32.33,46.43) ; v1(26.49,17.98) 26.49,12.8
  Inner2 w0.254: v1(32.33,46.43) 32.33,39.57 35.64,36.27 35.64,32.72 28.78,25.86 28.78,22.81 27.26,21.28 27.26,20.4 25.73,18.87 25.73,18.75 v1(26.49,17.98)
GREEN: length 13.9
  Top Layer w0.254: v1(31,19.69) 30.61,19.29 U1.26 ; 220Ω#3.1 38.37,28.58 v1(36.59,26.8)
  Bottom Layer w0.254: v1(36.59,26.8) 36.59,25.27 v1(31,19.69)
GYRO_SCL: length 15.3
  Top Layer w0.254: 4.7KΩ.2 33.77,35.69 33.77,38.99 32.24,40.51 29.45,40.51 29.19,40.77 29.19,42.29 28.94,42.55 27.04,42.55 4.7KΩ#4.2
GYRO_SDA: length 11.3
  Top Layer w0.254: 4.7KΩ#3.2 25,37.08 24.62,37.08 18.27,30.73 4.7KΩ#2.2
MISO_BARO: length 12.2
  Top Layer w0.254: U4.3 22.55,10.25 23.06,9.74 23.57,9.74 23.82,10 23.82,10.5 v1(24.51,11.2) ; v1(28.07,17.04) 28.32,17.29 U1.22
  Bottom Layer w0.254: v1(24.51,11.2) 24.51,13.48 v1(28.07,17.04)
MISO_FLASH: length 40.4
  Top Layer w0.254: v1(6.43,40.04) 6.43,41.29 U9.5 ; U1.35 26.5,23.28 v1(25.99,22.77)
  Inner1 w0.254: v1(6.43,40.04) 5.93,40.04 5.42,39.53 5.42,36.99 9.23,33.18 9.23,24.8 10.24,23.78 24.98,23.78 v1(25.99,22.77)
MOSI_BARO: length 13.4
  Top Layer w0.254: v1(31.02,17.39) 30.62,17.79 U1.23 ; U4.5 23.45,9.05 24.42,10.02 v1(24.42,10.27)
  Bottom Layer w0.254: v1(24.42,10.27) 25.18,11.03 25.18,11.54 v1(31.02,17.39)
MOSI_FLASH: length 34
  Top Layer w0.254: U9.6 3.56,41.91 v1(6.19,39.28) ; U1.36 26,25.31 26.51,25.82 v1(27.02,25.82)
  Inner1 w0.254: v1(6.19,39.28) 20.41,25.05 26.25,25.05 v1(27.02,25.82)
MOTOR1: length 29.6
  Top Layer w0.254: H1.1 42.16,15.24 42.16,35.29 100Ω.2
MOTOR2: length 38.5
  Top Layer w0.254: 100Ω#2.2 30.34,37.97 v1(31.75,37.97)
  Bottom Layer w0.254: H4.1 47.24,16.89 47.24,35.43 44.96,37.72 32,37.72 v1(31.75,37.97)
MOTOR3: length 34.1
  Top Layer w0.254: 100Ω#3.2 31.26,42.58 35.58,42.58 35.84,42.32 35.84,41.05 36.45,40.44 38.73,40.44 42.8,36.38 42.8,26.29 44.83,24.26 44.83,21.21 H5.1
MOTOR4: length 22
  Top Layer w0.254: v1(36.94,39.5) 36.18,39.5 100Ω#4.2
  Inner2 w0.254: H6.1 38.72,31.39 38.72,37.72 v1(36.94,39.5)
RED: length 21.2
  Top Layer w0.254: U1.25 28.22,18.79 v1(28.1,18.67) ; 220Ω#2.1 34.56,32.13 34.56,28.07 v1(32.02,25.53)
  Bottom Layer w0.254: v1(28.1,18.67) 29.48,20.05 29.48,22.99 v1(32.02,25.53)
SCK_BARO: length 12.1
  Top Layer w0.254: v1(23.65,11.2) 23.65,10.95 U4.4 ; U1.21 30.77,16.79 v1(31.02,16.54)
  Inner1 w0.254: v1(23.65,11.2) 24.41,11.97 26.45,11.97 v1(31.02,16.54)
SCK_FLASH: length 33.8
  Top Layer w0.254: U9.2 2.36,35.92 2.36,36.48 3.12,37.25 v1(4.14,37.25) ; U1.34 v1(27,22.77)
  Bottom Layer w0.254: v1(4.14,37.25) 7.44,37.25 22.68,22.01 26.24,22.01 v1(27,22.77)
SD_DAT0: length 17
  Top Layer w0.254: U1.39 24.5,25.56 v1(24.25,25.82) ; v1(17.8,36.08) 17.8,37.07 U33.7
  Inner2 w0.254: v1(17.8,36.08) 17.8,31.25 19.93,29.12 19.93,28.36 20.94,27.34 22.72,27.34 v1(24.25,25.82)
SD_DAT1: length 21.5
  Top Layer w0.254: U33.8 18.92,37.05 v1(18.92,35.98) ; v1(24.51,22.77) 24,23.28 U1.40
  Bottom Layer w0.254: v1(18.92,35.98) 19.94,35.98 21.2,34.71 21.2,29.88 19.43,28.1 19.43,26.58 20.19,25.82 21.46,25.82 v1(24.51,22.77)
SD_DAT2: length 23.4
  Top Layer w0.254: U33.1 10.89,37.38 v1(10.23,37.38) ; v1(16.48,26.37) 16.48,21.8 16.98,21.29 U1.51
  Inner2 w0.254: v1(16.48,26.37) 16.48,35.85 14.95,37.38 v1(10.23,37.38)
SD_DAT3: length 26
  Top Layer w0.254: U1.52 16.73,20.79 15.97,21.55 15.97,22.06 13.68,24.35 13.68,30.19 16.48,32.98 17.14,32.98 17.4,33.24 17.4,34.76 17.14,35.02 13.59,35.02 13.33,34.76 13.08,34.76 12.06,35.78 12.06,37.3 U33.2
SWCLK: length 35
  Top Layer w0.254: v1(25.91,20.19) 22.1,20.19 20,22.29 U1.49
  Bottom Layer w0.254: v1(25.91,20.19) 26.16,19.94 27.94,19.94 28.7,20.7 28.7,23.24 39.37,33.91 H3.4
SWDIO: length 30.5
  Top Layer w0.254: U1.46 21,26.46 v1(21.08,26.54)
  Bottom Layer w0.254: v1(21.08,26.54) 21.08,27.05 25.4,31.37 26.42,31.37 31.75,36.7 44.45,36.7 H3.3
$1N1: length 25.2
  Top Layer w0.254: v1(26.78,32.64) 26.02,33.4 22Ω#2.2 ; v1(30.26,14.28) 30.01,14.28 U1.17
  Inner1 w0.254: v1(26.78,32.64) 26.78,31.62 30.52,27.89 v1(30.52,26.36)
  Inner2 w0.254: v1(30.52,26.36) 30.52,26.11 32.8,23.83 32.8,20.02 30.26,17.47 v1(30.26,14.28)
$1N2: length 32
  Top Layer w0.254: U6.2 3.86,25.27 v1(4.77,25.27) ; 22Ω#2.1 23.77,34.67 v1(23,33.91)
  Inner2 w0.254: v1(23,33.91) 18.94,37.97 9.96,37.97 4.88,32.89 4.88,25.38 v1(4.77,25.27)
$1N3: length 26.7
  Top Layer w0.254: 22Ω.2 30.34,30.88 31.86,29.35 31.86,26.8 30.85,25.78 30.85,20.7 31.86,19.69 31.86,14.86 29.58,12.57 27.72,12.57 U1.16
$1N4: length 38
  Top Layer w0.254: v1(2.74,24.51) U6.3 ; 22Ω.1 v1(27.07,34.67)
  Inner2 w0.254: v1(27.07,34.67) 23.26,38.48 9.85,38.48 3.75,32.39 3.75,28.07 2.74,27.05 v1(2.74,24.51)
$1N7: length 30.5
  Top Layer w0.254: v1(28.07,20.98) 28.38,21.29 U1.30 ; C2.2 2.67,15.14 v1(4.19,16.66)
  Bottom Layer w0.254: v1(28.07,20.98) 27.81,21.23 26.04,21.23 21.21,16.41 12.21,16.41 11.7,16.92 4.45,16.92 v1(4.19,16.66)
$1N9: length 38.8
  Top Layer w0.254: v1(11.56,15.94) 11.56,17.72 11.81,17.97 11.81,18.99 C3.2 ; v1(5.72,29.66) 5.72,29.68 X1.2 ; v1(21.21,11.37) 21.59,11.37 21.97,11.75 21.97,12.76 U1.5
  Inner2 w0.254: v1(5.72,29.66) 5.72,21.78 v1(11.56,15.94)
  Bottom Layer w0.254: v1(21.21,11.37) 16.64,15.94 v1(11.56,15.94)
$1N10: length 31
  Top Layer w0.254: C15.2 12.57,16.7 12.32,16.96 v1(12.32,17.21) ; v1(20.7,14.42) 21.89,14.42 22.48,13.83 22.48,12.81 U1.6 ; v1(2.92,29.15) 2.92,29.75 X1.1
  Inner1 w0.254: v1(20.7,14.42) 15.11,14.42 v1(12.32,17.21)
  Bottom Layer w0.254: v1(2.92,29.15) 3.18,29.15 12.32,20 v1(12.32,17.21)
$1N15: length 33.4
  Top Layer w0.254: C8.1 27.62,3.05 v1(28.38,3.81) ; U3.10 26.03,28.96 26.54,28.96 28.13,27.37 v1(28.13,25.15)
  Inner1 w0.254: v1(26.61,20.57) 26.86,20.32 29.14,20.32 31.69,17.78 31.69,6.6 28.89,3.81 v1(28.38,3.81)
  Inner2 w0.254: v1(26.61,20.57) 26.61,21.34 27.88,22.61 27.88,24.89 v1(28.13,25.15)
$1N18: length 11.7
  Top Layer w0.254: C12.1 21.4,1.78 30.42,1.78 C7.1
$1N20: length 32.6
  Top Layer w0.254: C6.2 25.34,3.94 v1(24.58,4.7) ; U3.20 19.88,29.47 v1(19.24,28.83)
  Inner1 w0.254: v1(20.77,19.43) 21.53,18.67 21.53,12.57 20.51,11.56 20.51,8.76 v1(24.58,4.7)
  Inner2 w0.254: v1(19.24,28.83) 19.24,23.24 20.77,21.72 v1(20.77,19.43)
$1N23: length 51.2
  Top Layer w0.254: C1.2 31.56,10.8 v1(30.29,10.8) ; v1(18.1,12.57) 17.59,12.06 ; 17.59,12.06 17.38,11.85 U2.1 ; 17.59,12.06 17.59,11.81 21.66,7.75 21.79,7.75 22.67,6.86 22.67,5.84 20.39,3.56 17.85,3.56 C13.1 ; v1(5.4,11.3) 3.88,9.78 2.61,9.78 D1.3
  Inner1 w0.254: v1(5.4,11.3) 16.83,11.3 v1(18.1,12.57)
  Inner2 w0.254: v1(18.1,12.57) 18.61,12.57 19.11,12.06 25.72,12.06 26.99,10.8 v1(30.29,10.8)
$1N24: length 21.8
  Top Layer w0.254: C1.1 v1(30.16,9.53) ; v1(13.65,12.06) 12.9,12.06 U2.3
  Inner2 w0.254: v1(30.16,9.53) 25.08,9.53 22.8,7.24 18.48,7.24 v1(13.65,12.06)
$1N49: length 14.6
  Top Layer w0.254: v1(4.21,34.54) 4.21,35.19 U9.3 ; v1(6.24,33.27) 15.64,33.27 10KΩ.1
  Inner1 w0.254: v1(6.24,33.27) 5.48,33.27 v1(4.21,34.54)
$1N50: length 42.7
  Top Layer w0.254: 10KΩ#2.1 31.26,31.11 31.26,35.43 29.73,36.96 29.48,36.96 29.23,37.21 29.23,38.73 27.45,40.51 25.31,40.51 25.16,40.66 25.16,42.04 22.88,44.32 3.32,44.32 2.3,43.31 2.3,42.92 U9.7
$1N54: length 16.8
  Top Layer w0.254: v1(23.25,25.78) 23,25.52 U1.42 ; v1(27.45,29.97) 29.23,31.75 29.23,35.56 28.21,36.58 100Ω#2.1
  Bottom Layer w0.254: v1(27.45,29.97) v1(23.25,25.78)
$1N55: length 23.4
  Top Layer w0.254: v1(22.66,22.93) 22.5,23.09 U1.43 ; 100Ω#3.1 v1(28.25,40.55)
  Inner1 w0.254: v1(29.52,30.29) 28.25,31.56 v1(28.25,40.55)
  Inner2 w0.254: v1(29.52,30.29) 29.52,30.04 22.66,23.18 v1(22.66,22.93)
$1N56: length 18.3
  Top Layer w0.254: v1(22.37,25.91) 22,25.54 U1.44 ; v1(31.77,35.81) 32.78,36.83 100Ω#4.1
  Bottom Layer w0.254: v1(22.37,25.91) 31.77,35.31 v1(31.77,35.81)
$1N58: length 6.9
  Top Layer w0.254: U3.24 19.03,27.47 4.7KΩ#2.1
$1N60: length 15.2
  Top Layer w0.254: 4.7KΩ.1 32.78,34.42 v1(32.02,33.66) ; U3.23 21.35,27.97 v1(21.26,28.07)
  Inner2 w0.254: v1(32.02,33.66) 26.85,33.66 v1(21.26,28.07)
$1N63: length 30
  Top Layer w0.254: U1.58 17.02,17.79 16.4,18.42 v1(16.4,20.19) ; v1(15.89,22.99) 15.38,23.5 15.38,31.11 15.64,31.37 17.42,31.37 19.45,33.4 19.45,34.67 21.99,37.21 21.99,39.5 4.7KΩ#4.1
  Bottom Layer w0.254: v1(15.89,22.99) 15.89,20.7 v1(16.4,20.19)
$1N64: length 29.9
  Top Layer w0.254: U1.59 16.89,17.29 15.38,18.8 15.38,21.84 13.1,24.13 13.1,30.48 v1(14.88,32.26) ; 4.7KΩ#3.1 v1(20.46,34.54)
  Bottom Layer w0.254: v1(14.88,32.26) 18.18,32.26 v1(20.46,34.54)
$1N71: length 22.6
  Top Layer w0.254: 100Ω.1 v1(34.94,35.94) ; v1(23.5,22.81) U1.41
  Inner2 w0.254: v1(34.94,35.94) 34.94,34.67 23.5,23.23 v1(23.5,22.81)
$1N83: length 21
  Top Layer w0.254: 6.1,18.68 6.1,18.61 v1(8.45,16.26) ; v1(14.04,10.67) 14.54,10.16 18.1,10.16 C16.2
  Bottom Layer w0.254: v1(14.04,10.67) v1(8.45,16.26)
$1N84: length 37.2
  Top Layer w0.254: U16.1 9.59,27.93 9.14,27.93 6.1,24.89 6.1,24.38 5.84,24.12 5.84,19.81 5.33,19.3 5.33,12.95 7.87,10.41 D2.1 8.39,7.87 18.98,7.87 C16.1
$1N87: length 37
  Top Layer w0.254: 32.4KΩ.2 35.02,17.89 v1(35.02,18.83) ; 8.64,24.5 8.76,24.63 8.76,24.75 9.52,25.51 10.54,25.51 12.57,23.48 C10.2 14.86,21.02 14.86,18.48 v1(15.88,17.46)
  Inner2 w0.254: v1(35.02,18.83) 35.02,18.07 30.61,13.65 29.34,13.65 25.53,17.46 v1(15.88,17.46)
$1N88: length 12.4
  Top Layer w0.254: C11.2 34.1,7.62 34.1,14.99 33.09,16 32.4KΩ.1
$1N90: length 25.5
  Top Layer w0.254: v1(11.03,18.8) 10.02,18.8 U5.4 ; v1(29.32,27.43) 30.59,28.7 178KΩ.2
  Inner2 w0.254: v1(11.03,18.8) 21.45,18.8 25.26,22.61 25.26,23.11 29.32,27.18 v1(29.32,27.43)
$1N93: length 32.9
  Top Layer w0.254: 8.45KΩ.2 35.16,14.61 34.15,15.62 34.15,18.92 33.16,19.91 118KΩ.1 33.16,21.72 v1(32.15,22.73) ; U5.5 9.92,24.51 v1(10.56,24.51)
  Inner1 w0.254: v1(10.56,24.51) 30.37,24.51 v1(32.15,22.73)
$1N107: length 33.5
  Top Layer w0.254: v1(34.8,39.45) 34.8,41.57 ; U18.1 37.59,26.24 v1(37.34,26.5)
  Inner2 w0.254: v1(34.8,39.45) 37.34,36.91 v1(37.34,26.5)
$1N112: length 48.2
  Top Layer w0.254: v1(14.36,3.06) 13.6,2.3 LED1.2 ; v1(36.71,19.82) 36.71,25.67 35.95,26.43 35.95,27.19 37.47,28.71 37.47,33.04 220Ω#2.2
  Bottom Layer w0.254: v1(14.36,3.06) 14.36,3.82 19.18,8.65 26.3,8.65 36.71,19.06 v1(36.71,19.82)
$1N113: length 60.5
  Top Layer w0.254: LED1.1 7.49,1.53 8.24,0.77 37.71,0.77 39.75,2.81 39.75,28.21 220Ω#3.2
$1N114: length 38.6
  Top Layer w0.254: v1(15.08,3.29) 14.58,3.8 LED1.4 ; v1(35.15,16.24) 35.41,16.24 36.09,16.93 36.09,23.71 220Ω.2
  Bottom Layer w0.254: v1(15.08,3.29) 24.99,3.29 35.15,13.45 v1(35.15,16.24)

## Copper pours and planes (outline as drawn; the poured copper is in the pictures)
GND on Top Layer: 0,49.75 47.5,49.75 47.5,0.25 0,0.25
GND on Inner1: 0.25,49.53 47.37,49.53 47.37,0.38 0.25,0.38
